# EAGLE design RAMPS_FanSpansion (EAGLE 7.6.0)
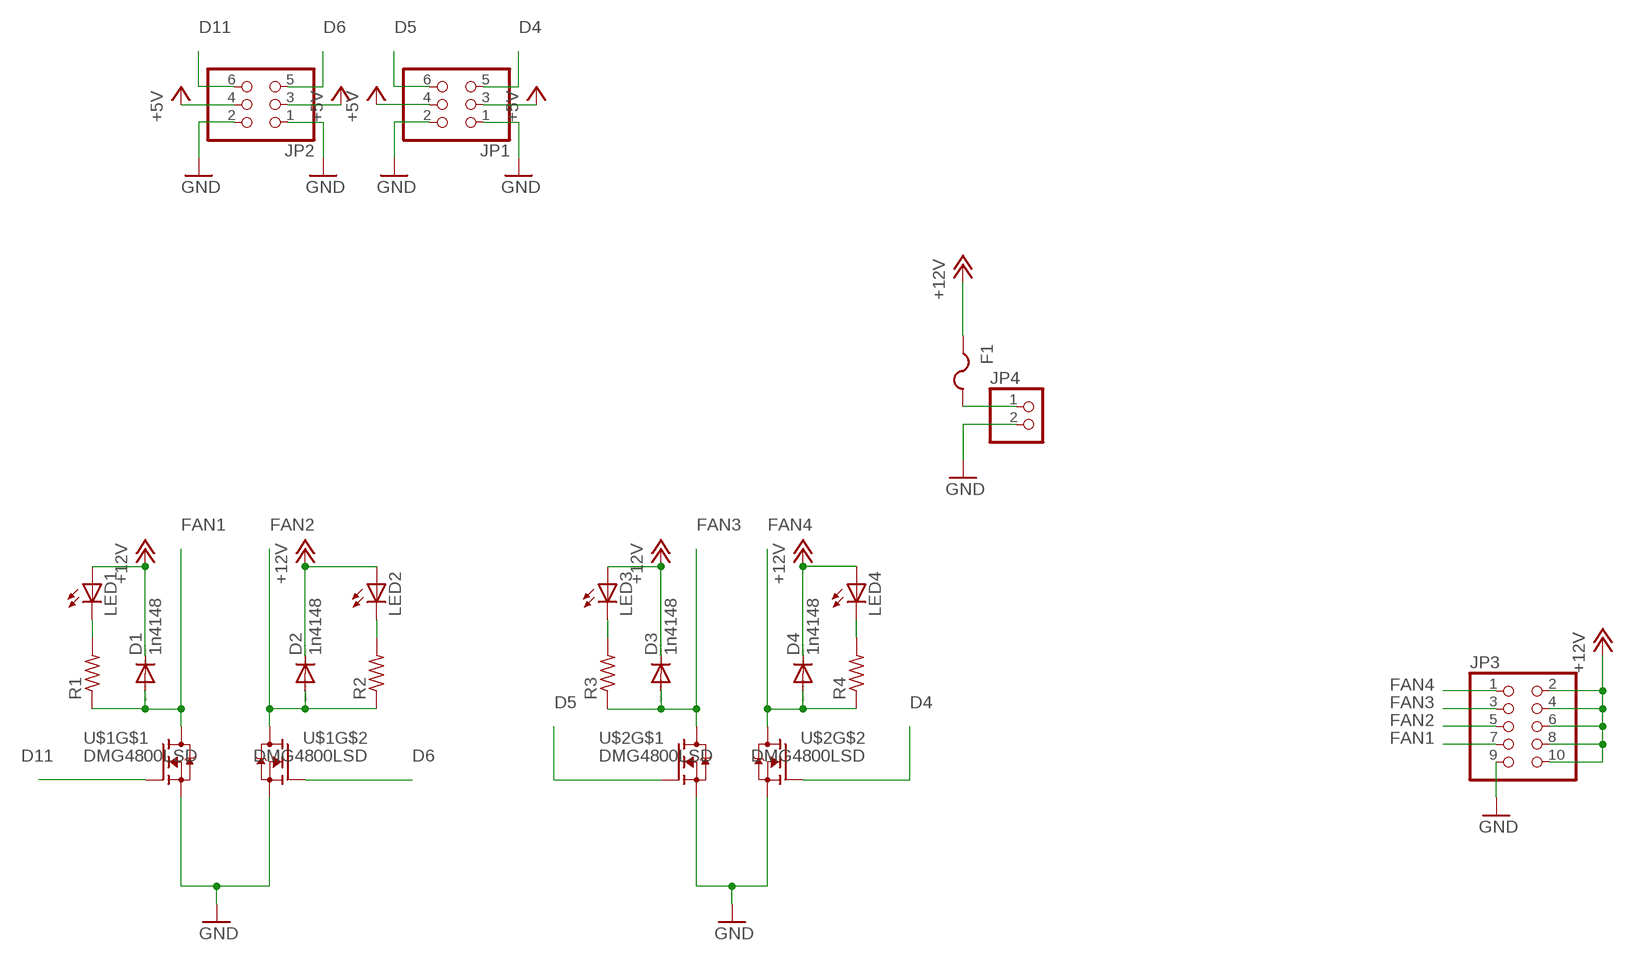
[diagram p0: schematic, sheet 1]

## Parts
D1  1n4148  DIODE-SOD323-R  [SOD323-R]
D2  1n4148  DIODE-SOD323-R  [SOD323-R]
D3  1n4148  DIODE-SOD323-R  [SOD323-R]
D4  1n4148  DIODE-SOD323-R  [SOD323-R]
F1  PTCFUSE-1812  [1812]
JP1  PINHD-2X3  [2X03]
JP2  PINHD-2X3  [2X03]
JP3  PINHD-2X5  [2X05]
JP4  PINHD-1X2  [1X02]
LED1  LEDSML0805  [SML0805]
LED2  LEDSML0805  [SML0805]
LED3  LEDSML0805  [SML0805]
LED4  LEDSML0805  [SML0805]
R1  R-US_R0805  [R0805]
R2  R-US_R0805  [R0805]
R3  R-US_R0805  [R0805]
R4  R-US_R0805  [R0805]
U$1  DMG4800LSD  [SO08]
U$2  DMG4800LSD  [SO08]

## Nets
+5V: JP1.3 JP1.4 JP2.3 JP2.4
+12V: D1.C D2.C D3.C D4.C F1.1 JP3.2 JP3.4 JP3.6 JP3.8 JP3.10 LED1.A LED2.A LED3.A LED4.A
D4: JP1.5 U$2.4(G)
D5: JP1.6 U$2.2(G)
D6: JP2.5 U$1.4(G)
D11: JP2.6 U$1.2(G)
FAN1: D1.A JP3.7 R1.1 U$1.7(D) U$1.8(D)
FAN2: D2.A JP3.5 R2.1 U$1.5(D) U$1.6(D)
FAN3: D3.A JP3.3 R3.1 U$2.7(D) U$2.8(D)
FAN4: D4.A JP3.1 R4.1 U$2.5(D) U$2.6(D)
GND: JP1.1 JP1.2 JP2.1 JP2.2 JP3.9 JP4.2 U$1.1(S) U$1.3(S) U$2.1(S) U$2.3(S)
N$1: LED1.C R1.2
N$2: LED2.C R2.2
N$3: LED3.C R3.2
N$4: LED4.C R4.2
N$6: F1.2 JP4.1

## Library data of the parts
D1-D4 = diode:DIODE-: DIODE
F1 = adafruit:PTCFUSE: PTC fuses, resettable thermistors
JP1 JP2 = pinhead:PINHD-2X3: PIN HEADER
JP3 = pinhead:PINHD-2X5: PIN HEADER
JP4 = pinhead:PINHD-1X2: PIN HEADER
LED1-LED4 = led:LED: LED OSRAM: - CHIPLED LG R971, LG N971, LY N971, LG Q971, LY Q971, LO R971, LY R971 LH N974, LH R974 LS Q976, LO Q976, LY Q976 LO Q996 - Hyper CHIPLED LW Q18S LB Q993, LB Q99A, LB R99A - SideLED LS A670, LO A670, LY A670, LG A670, LP A670 LB A673, LV A673, LT A673, LW A673 LH A674 LY A675 LS A676, LA A676, LO A676, LY A676, LW A676 LS A679, LY A679, LG A679 - Hyper Micro SIDELED® LS Y876, LA Y876, LO Y876, LY Y876 LT Y87S - SmartLED LW L88C, LW L88S LB L89C, LB L89S, LG L890 LS L89K, LO L89K, LY L89K LS L896, LA L896, LO L896, LY L896 - TOPLED LS T670, LO T670, LY T670, LG T670, LP T670 LSG T670, LSP T670, LSY T670, LOP T670, LYG T670 LG T671, LOG T671, LSG T671 LB T673, LV T673, LT T673, LW T673 LH T674 LS T676, LA T676, LO T676, LY T676, LB T676, LH T676, LSB T676, LW T676 LB T67C, LV T67C, LT T67C, LS T67K, LO T67K, LY T67K, LW E67C LS E67B, LA E67B, LO E67B, LY E67B, LB E67C, LV E67C, LT E67C LW T67C LS T679, LY T679, LG T679 LS T770, LO T770, LY T770, LG T770, LP T770 LB T773, LV T773, LT T773, LW T773 LH T774 LS E675, LA E675, LY E675, LS T675 LS T776, LA T776, LO T776, LY T776, LB T776 LHGB T686 LT T68C, LB T68C - Hyper Mini TOPLED® LB M676 - Mini TOPLED Santana® LG M470 LS M47K, LO M47K, LY M47K Source: http://www.osram.convergy.de LUXEON: - LUMILED® LXK2-PW12-R00, LXK2-PW12-S00, LXK2-PW14-U00, LXK2-PW14-V00 LXK2-PM12-R00, LXK2-PM12-S00, LXK2-PM14-U00 LXK2-PE12-Q00, LXK2-PE12-R00, LXK2-PE12-S00, LXK2-PE14-T00, LXK2-PE14-U00 LXK2-PB12-K00, LXK2-PB12-L00, LXK2-PB12-M00, LXK2-PB14-N00, LXK2-PB14-P00, LXK2-PB14-Q00 LXK2-PR12-L00, LXK2-PR12-M00, LXK2-PR14-Q00, LXK2-PR14-R00 LXK2-PD12-Q00, LXK2-PD12-R00, LXK2-PD12-S00 LXK2-PH12-R00, LXK2-PH12-S00 LXK2-PL12-P00, LXK2-PL12-Q00, LXK2-PL12-R00 Source: www.luxeon.com KINGBRIGHT: KA-3528ASYC Source: www.kingbright.com
R1-R4 = resistor:R-US_: RESISTOR, American symbol
U$1 U$2 = RobThePyro:DMG4800LSD

## Board
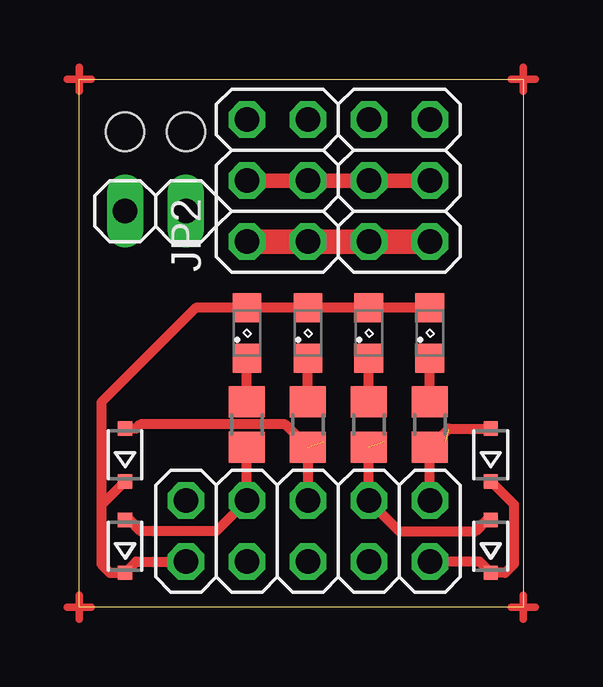
[diagram p1: board, top side]
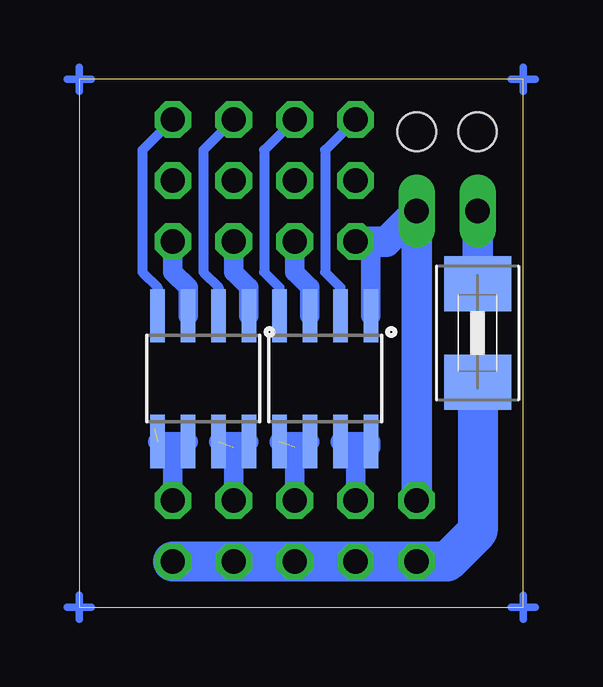
[diagram p2: board, bottom side, seen from below]

Size 18.5 x 22 mm. Coordinates in mm from the lower left corner, seen from the top.
Outline: 0,0 0,22 18.5,22 18.5,0 0,0
Copper layers (1*16): Top 0.035mm / dielectric 1.5mm / Bottom 0.035mm
Design rules "default": minimum track width 10mil, minimum drill 24mil, track to track 8mil, track to pad 8mil, pad to pad 8mil, via to via 8mil, smd to smd 8mil, copper to edge 40mil, drill to drill 8mil, minimum pad ring 10mil, minimum via ring 8mil, stop-mask expansion 4mil, vias tented up to drill 0mil, thermal gap 10mil
Holes 1.6 mm at 1.91,19.82 4.45,19.82

### Footprints (pad centres in the part's own frame; a part is rotated, then mirrored left to right if it is on the bottom)
SOD323-R = smd 0.6 x 0.6: A 1.1,0; C -1.1,0
1812 = smd 2.286 x 2.794: 1 -2.046,0; 2 2.046,0
2X03 = drill 1.016 octagon: 1 -2.54,-1.27; 2 -2.54,1.27; 3 0,-1.27; 4 0,1.27; 5 2.54,-1.27; 6 2.54,1.27
2X05 = drill 1.016 octagon: 1 -5.08,-1.27; 2 -5.08,1.27; 3 -2.54,-1.27; 4 -2.54,1.27; 5 0,-1.27; 6 0,1.27; 7 2.54,-1.27; 8 2.54,1.27; 9 5.08,-1.27; 10 5.08,1.27
1X02 = drill 1.016 long: 1 -1.27,0; 2 1.27,0
SML0805 = smd 1.2 x 1.2: A 1.05,0; C -1.05,0
R0805 = smd 1.3 x 1.5: 1 -0.95,0; 2 0.95,0
SO08 = smd 0.61 x 2.21: 1 -1.905,-2.616; 2 -0.635,-2.616; 3 0.635,-2.616; 4 1.905,-2.616; 5 1.905,2.616; 6 0.635,2.616; 7 -0.635,2.616; 8 -1.905,2.616

### Placement (x,y rotation side)
D1  1.91,2.54 90 top
D2  1.91,6.35 90 top
D3  17.14,2.54 90 top
D4  17.14,6.35 90 top
F1  1.91,11.43 90 bottom
JP1  13.34,17.78 90 top
JP2  8.26,17.78 90 top
JP3  9.53,3.17 180 top
JP4  3.17,16.51 0 top
LED1  6.99,11.43 90 top
LED2  9.53,11.43 90 top
LED3  12.06,11.43 90 top
LED4  14.61,11.43 90 top
R1  6.99,7.62 90 top
R2  9.53,7.62 90 top
R3  12.06,7.62 90 top
R4  14.61,7.62 90 top
U$1  8.26,9.53 180 bottom
U$2  13.34,9.53 180 bottom

### Tracks (layer width: path | path; a pad name or v marks a point on that pad's centre or on a via)
+5V
  Top 0.61: JP2.4 JP2.3 JP1.4 JP1.3
+12V
  Top 0.406: LED4.A LED3.A LED2.A LED1.A 4.86,12.48 0.91,8.53 0.91,4.26 | D4.C 18.11,4.29 18.11,1.8 17.75,1.44 D3.C 16.68,1.91 JP3.2 | D2.C 0.91,4.26 | 0.91,4.26 0.91,1.8 1.28,1.44 D1.C 2.37,1.91 JP3.10
  Bottom 1.676: F1.1 1.91,3.17 3.17,1.91 JP3.10 JP3.8 JP3.6 JP3.4 JP3.2
D4
  Bottom 0.406: JP1.5 15.88,19.05 15.88,13.97 15.24,13.34 U$2.4
D5
  Bottom 0.406: JP1.6 13.34,19.05 13.34,13.97 12.7,13.34 U$2.2
D6
  Bottom 0.406: JP2.5 10.79,19.05 10.79,13.97 10.16,13.34 U$1.4
D11
  Bottom 0.406: JP2.6 8.26,19.05 8.26,13.97 7.62,13.34 U$1.2
FAN1
  Top 0.406: R1.1 JP3.7 5.71,3.17 2.54,3.17 2.08,3.64 D1.A
  Bottom 0.813: JP3.7 R1.1 6.35,6.67 U$1.8 U$1.7
FAN2  (1 unrouted)
  Top 0.406: JP3.5 R2.1 8.57,7.62 2.54,7.62 2.37,7.45 D2.A
  Bottom 0.813: U$1.6 U$1.5 | JP3.5 R2.1
FAN3  (1 unrouted)
  Top 0.406: R3.1 JP3.3 13.34,3.17 16.51,3.17 16.98,3.64 D3.A
  Bottom 0.813: U$2.8 U$2.7 | JP3.3 R3.1
FAN4  (1 unrouted)
  Top 0.406: JP3.1 R4.1 15.38,7.45 D4.A
  Bottom 0.813: U$2.6 U$2.5 | JP3.1 R4.1
GND
  Top 1.016: JP2.2 JP2.1 JP1.2 JP1.1
  Bottom 0.813: U$1.1 6.35,14.61 JP2.2 | U$1.3 8.89,13.34 9.53,13.97 JP2.1 | U$2.1 11.43,13.34 12.06,13.97 JP1.2 | U$2.3 13.97,13.34 14.61,13.97 JP1.1
  Bottom 1.27: JP3.9 JP4.2 5.71,15.24 JP2.2
N$1
  Top 0.406: R1.2 LED1.C
N$2
  Top 0.406: R2.2 LED2.C
N$3
  Top 0.406: R3.2 LED3.C
N$4
  Top 0.406: R4.2 LED4.C
N$5
  Bottom 0.305: 0,-0.5 0,0.5
N$6
  Bottom 1.27: JP4.1 F1.2
N$7
  Bottom 0.305: -0.5,0 0.5,0
N$8
  Bottom 0.305: 18,0 19,0
N$9
  Bottom 0.305: 18.5,-0.5 18.5,0.5
N$10
  Bottom 0.305: 18.5,22.5 18.5,21.5
N$11
  Bottom 0.305: 18,22 19,22
N$12
  Bottom 0.305: 0,22.5 0,21.5
N$13
  Bottom 0.305: -0.5,22 0.5,22
N$14
  Top 0.305: 0,22.5 0,21.5
N$15
  Top 0.305: -0.5,22 0.5,22
N$16
  Top 0.305: 18.5,22.5 18.5,21.5
N$17
  Top 0.305: 19,22 18,22
N$18
  Top 0.305: 18.5,0.5 18.5,-0.5
N$19
  Top 0.305: 18,0 19,0
N$20
  Top 0.305: 0,0.5 0,-0.5
N$21
  Top 0.305: -0.5,0 0.5,0